# Altium schematic sheet TKeyboard_2021-06-10.schdoc
size 306 x 219 mm
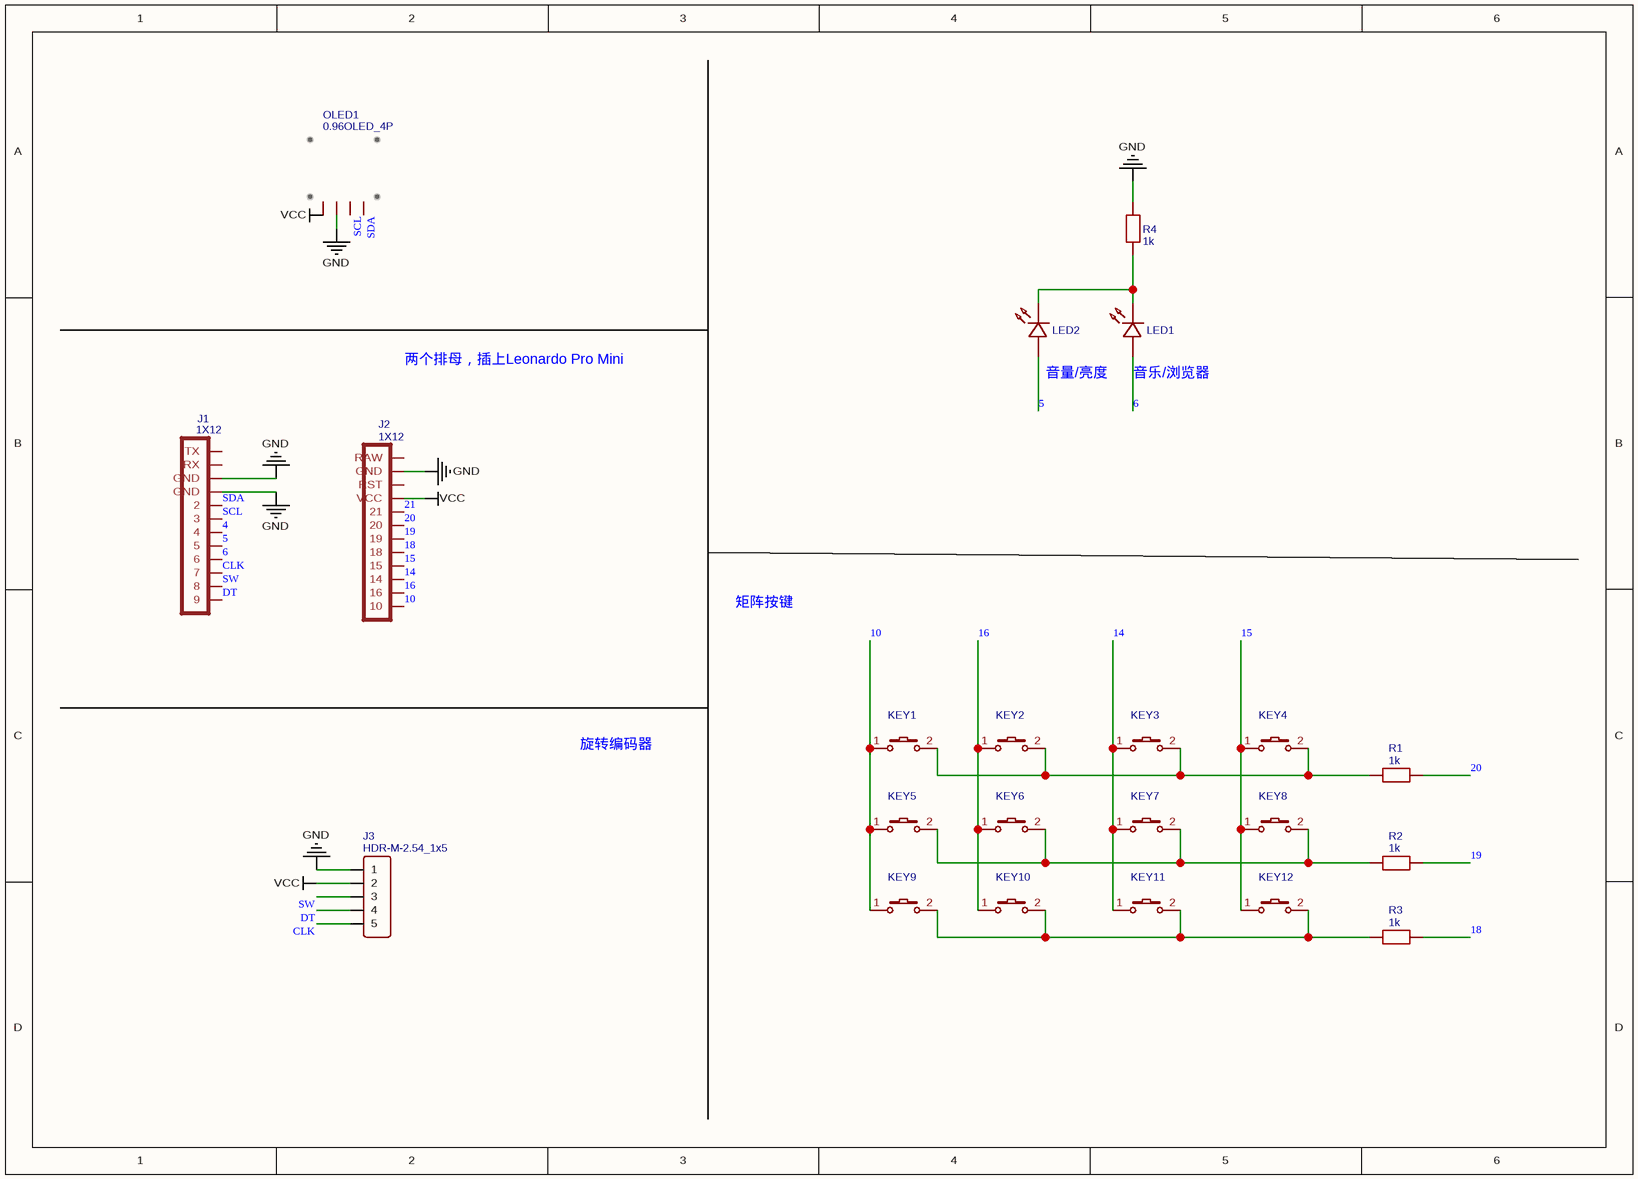
[diagram p0: TKeyboard_2021-06-10.schdoc]

## Parts
J1  1X12  [1X12]
J2  1X12  [1X12]
J3  HDR-M-2.54_1x5  [HDR-M-2.54_1X5]
KEY1  K2-3.6×6.1_SMD  [KEY-SMD_2P-L6.0-W3.5-P8.00-L]  (value not drawn)
KEY2  K2-3.6×6.1_SMD  [KEY-SMD_2P-L6.0-W3.5-P8.00-L]  (value not drawn)
KEY3  K2-3.6×6.1_SMD  [KEY-SMD_2P-L6.0-W3.5-P8.00-L]  (value not drawn)
KEY4  K2-3.6×6.1_SMD  [KEY-SMD_2P-L6.0-W3.5-P8.00-L]  (value not drawn)
KEY5  K2-3.6×6.1_SMD  [KEY-SMD_2P-L6.0-W3.5-P8.00-L]  (value not drawn)
KEY6  K2-3.6×6.1_SMD  [KEY-SMD_2P-L6.0-W3.5-P8.00-L]  (value not drawn)
KEY7  K2-3.6×6.1_SMD  [KEY-SMD_2P-L6.0-W3.5-P8.00-L]  (value not drawn)
KEY8  K2-3.6×6.1_SMD  [KEY-SMD_2P-L6.0-W3.5-P8.00-L]  (value not drawn)
KEY9  K2-3.6×6.1_SMD  [KEY-SMD_2P-L6.0-W3.5-P8.00-L]  (value not drawn)
KEY10  K2-3.6×6.1_SMD  [KEY-SMD_2P-L6.0-W3.5-P8.00-L]  (value not drawn)
KEY11  K2-3.6×6.1_SMD  [KEY-SMD_2P-L6.0-W3.5-P8.00-L]  (value not drawn)
KEY12  K2-3.6×6.1_SMD  [KEY-SMD_2P-L6.0-W3.5-P8.00-L]  (value not drawn)
LED1  LED-0603_R  [LED0603_RED]  (value not drawn)
LED2  LED-0603_R  [LED0603_RED]  (value not drawn)
OLED1  0.96OLED_4P  [0.96OLED_4P]
R1  1k  [R0603]
R2  1k  [R0603]
R3  1k  [R0603]
R4  1k  [R0603]

## Nets
GND: J1.9(GND) J1.10(GND) J2.11(GND) J3.1 OLED1.2 R4.2
VCC: J2.9(VCC) J3.2 OLED1.1
4: J1.6(4)
5: J1.5 LED2.1
6: J1.4(6) LED1.1
10: J2.1(10) KEY1.1 KEY5.1 KEY9.1
14: J2.3(14) KEY3.1 KEY7.1 KEY11.1
15: J2.4(15) KEY4.1 KEY8.1 KEY12.1
16: J2.2(16) KEY2.1 KEY6.1 KEY10.1
18: J2.5(18) R3.2
19: J2.6(19) R2.2
20: J2.7(20) R1.2
21: J2.8(21)
CLK: J1.3(7) J3.5
DT: J1.1(9) J3.4
SCL: J1.7(3) OLED1.3
SDA: J1.8(2) OLED1.4
SW: J1.2(8) J3.3
NetKEY1_2: KEY1.2 KEY2.2 KEY3.2 KEY4.2 R1.1
NetKEY5_2: KEY5.2 KEY6.2 KEY7.2 KEY8.2 R2.1
NetKEY9_2: KEY9.2 KEY10.2 KEY11.2 KEY12.2 R3.1
NetLED1_2: LED1.2 LED2.2 R4.1

Not connected (* = marked no-connect by the designer): J1 11(RX) 12(TX); J2 10(RST) 12(RAW)

## Notes on the sheet
- 两个排母，插上Leonardo Pro Mini
- (near LED2) 音量/亮度
- (near LED1) 音乐/浏览器
- 矩阵按键
- 旋转编码器
- (in symbol 0.96OLED_4P) Hello World!!!

## Library data of the parts
J1 J2 = 1X12: description: null; spicePre: J; spiceSymbolName: 1X12
J3 = HDR-M-2.54_1x5: Contributor: LCEDA_Lib; BOM_Supplier Part: C358687; BOM_Supplier: LCSC; spicePre: J; spiceSymbolName: HDR-M-2.54_1x5
KEY1-KEY12 = K2-3.6×6.1_SMD: BOM_Manufacturer Part: K2-1107ST-A4SW-06; Contributor: LCEDA_Lib; 制造商: 韩国韩荣; BOM_Supplier Part: C118141; BOM_Supplier: LCSC; spicePre: K; spiceSymbolName: K2-3.6×6.1_SMD
LED1 LED2 = LED-0603_R: BOM_Manufacturer: EVERLIGHT(台湾亿光); BOM_Manufacturer Part: 19-217/R6C-AL1M2VY/3T; Contributor: LCEDA_01; BOM_Supplier Part: C72044; BOM_Supplier: LCSC; spicePre: L; spiceSymbolName: LED-0603_R
OLED1 = 0.96OLED_4P: Contributor: LCEDA_Lib; BOM_Supplier: LCSC; spicePre: O; spiceSymbolName: 0.96OLED_4P
R1-R4 = 1k: nameAlias: Value(Ω); Contributor: LCEDA_Lib; spicePre: R; spiceSymbolName: R_0603_EU